# Altium schematic sheet DAC Output.SchDoc
size A3
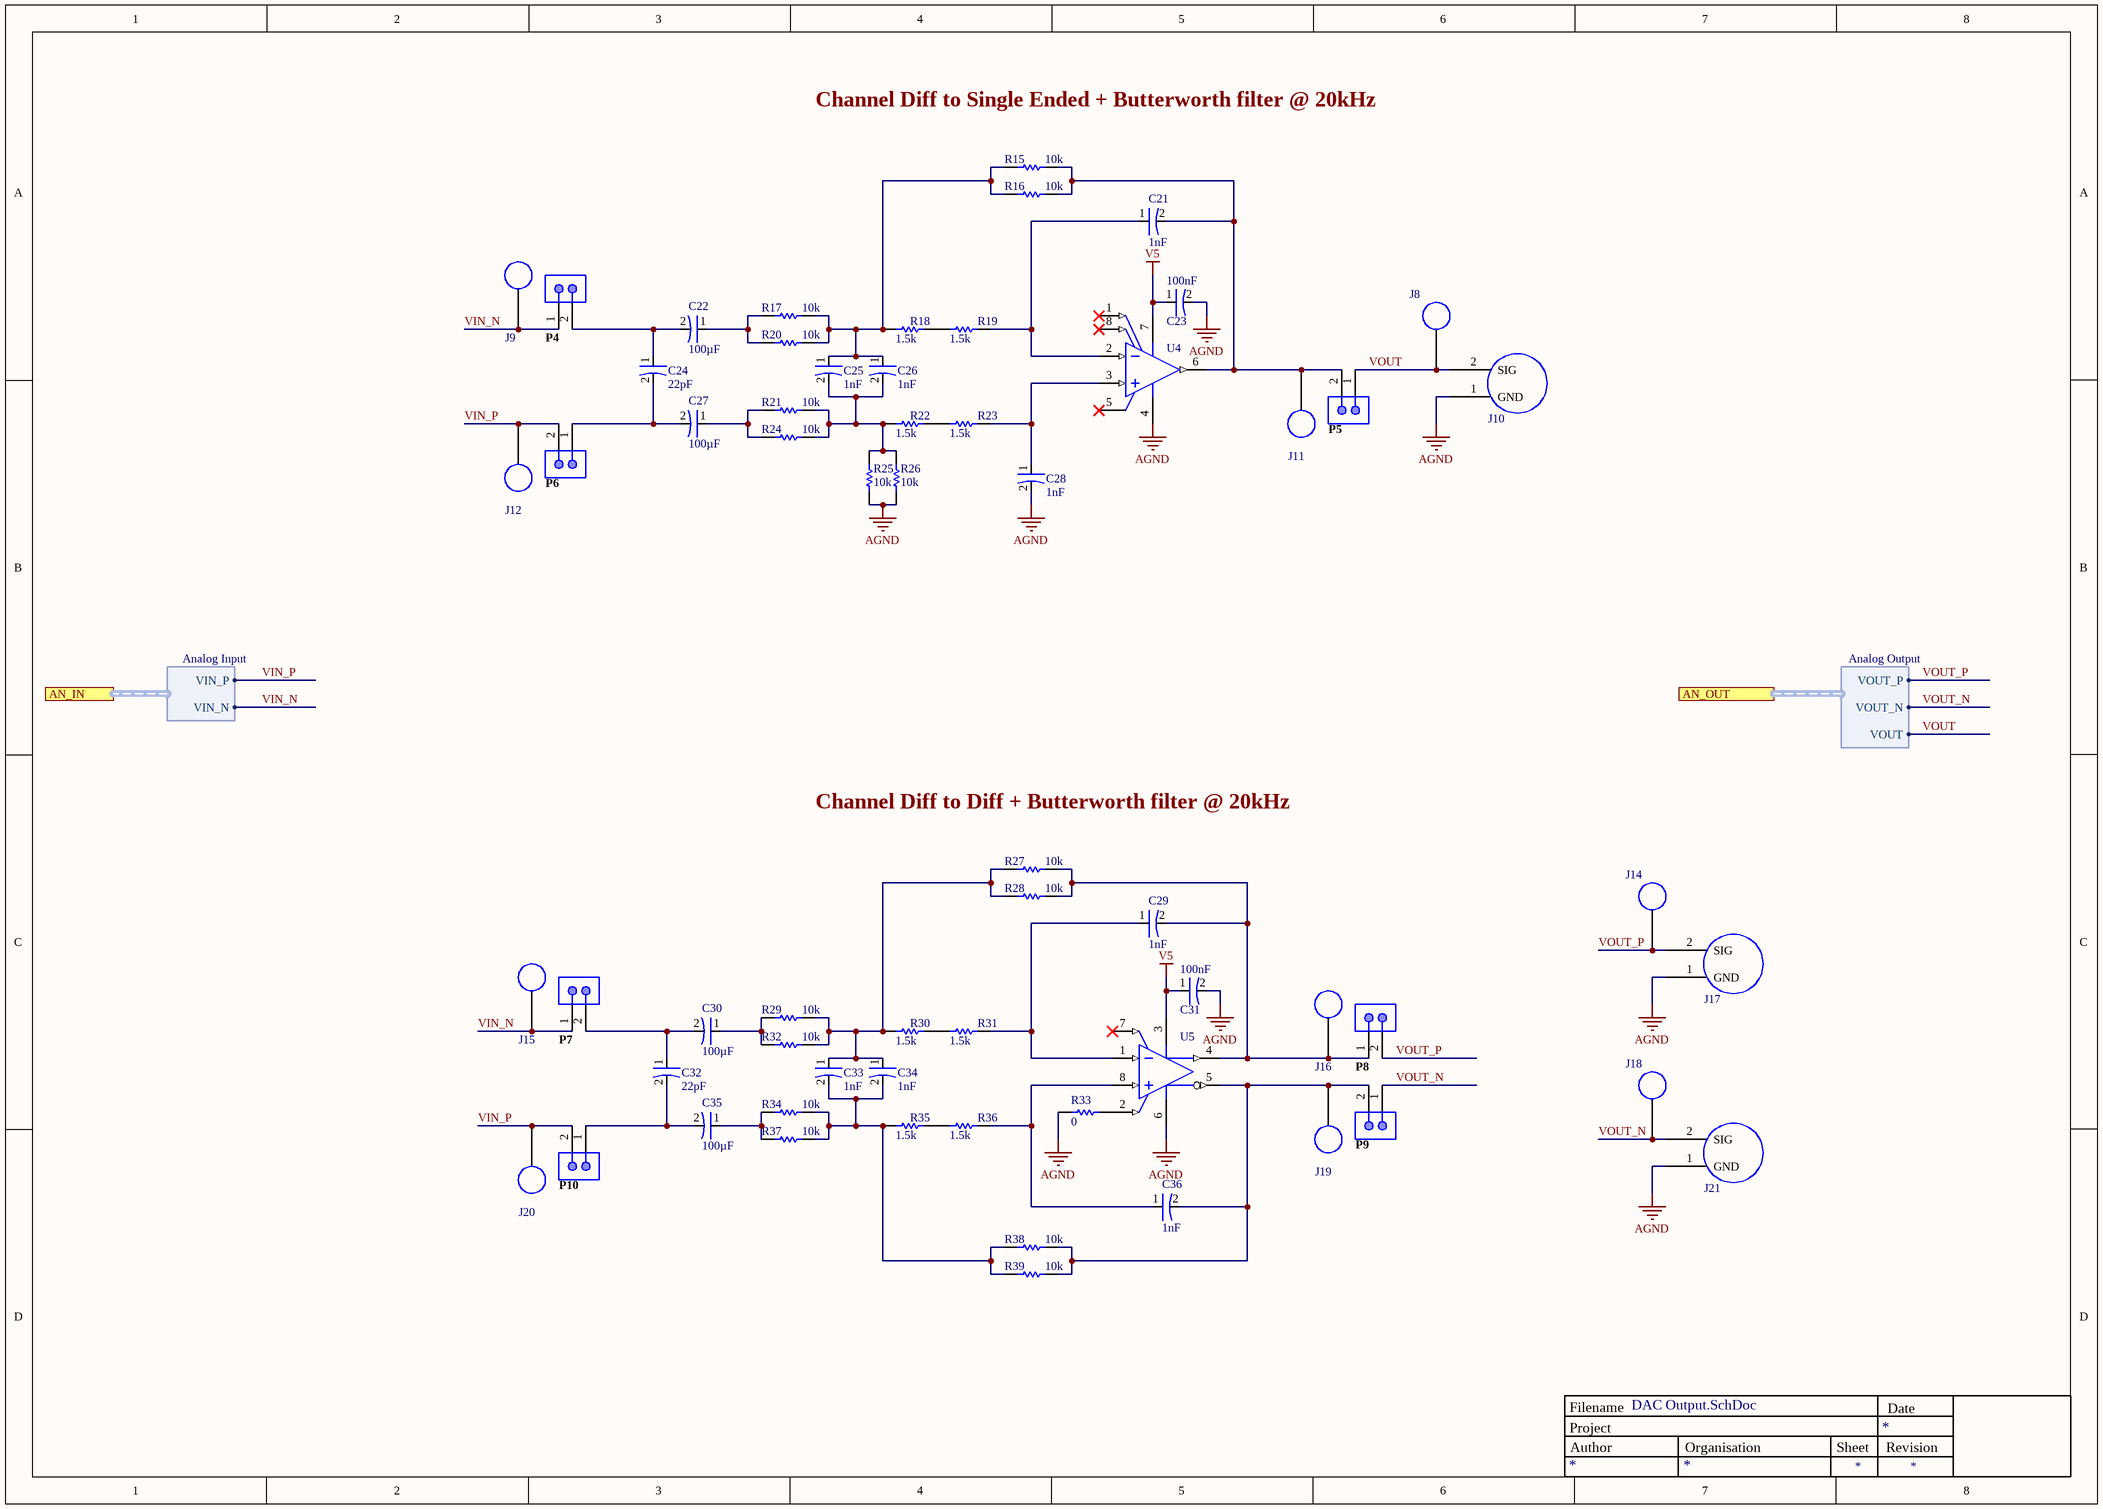
[diagram p0: DAC Output.SchDoc]

## Parts
C21  value 1nF  [0402-M]  (hidden comment: CAP 1nF CER 0402 50V X5R 10%)
C22  value 100µF  [1210-M]  (hidden comment: CAP 100uF CER 1210 16V X5R 20%)
C23  value 100nF  [0805-M]  (hidden comment: CAP 0.1uF CER 0805 50V  X7R 5%)
C24  value 22pF  [0805-M]  (hidden comment: CAP 22pF CER 0805 50V C0G 2%)
C25  value 1nF  [0402-M]  (hidden comment: CAP 1nF CER 0402 50V X5R 10%)
C26  value 1nF  [0402-M]  (hidden comment: CAP 1nF CER 0402 50V X5R 10%)
C27  value 100µF  [1210-M]  (hidden comment: CAP 100uF CER 1210 16V X5R 20%)
C28  value 1nF  [0402-M]  (hidden comment: CAP 1nF CER 0402 50V X5R 10%)
C29  value 1nF  [0402-M]  (hidden comment: CAP 1nF CER 0402 50V X5R 10%)
C30  value 100µF  [1210-M]  (hidden comment: CAP 100uF CER 1210 16V X5R 20%)
C31  value 100nF  [0805-M]  (hidden comment: CAP 0.1uF CER 0805 50V  X7R 5%)
C32  value 22pF  [0805-M]  (hidden comment: CAP 22pF CER 0805 50V C0G 2%)
C33  value 1nF  [0402-M]  (hidden comment: CAP 1nF CER 0402 50V X5R 10%)
C34  value 1nF  [0402-M]  (hidden comment: CAP 1nF CER 0402 50V X5R 10%)
C35  value 100µF  [1210-M]  (hidden comment: CAP 100uF CER 1210 16V X5R 20%)
C36  value 1nF  [0402-M]  (hidden comment: CAP 1nF CER 0402 50V X5R 10%)
J8  151-203-RC  [151-203-RC-Footprint-1]  (value not drawn)
J9  151-203-RC  [151-203-RC-Footprint-1]  (value not drawn)
J10  SMA CONNECTOR  [SMA CONNECTOR-Footprint-1]  (value not drawn)
J11  151-203-RC  [151-203-RC-Footprint-1]  (value not drawn)
J12  151-203-RC  [151-203-RC-Footprint-1]  (value not drawn)
J14  151-203-RC  [151-203-RC-Footprint-1]  (value not drawn)
J15  151-203-RC  [151-203-RC-Footprint-1]  (value not drawn)
J16  151-203-RC  [151-203-RC-Footprint-1]  (value not drawn)
J17  SMA CONNECTOR  [SMA CONNECTOR-Footprint-1]  (value not drawn)
J18  151-203-RC  [151-203-RC-Footprint-1]  (value not drawn)
J19  151-203-RC  [151-203-RC-Footprint-1]  (value not drawn)
J20  151-203-RC  [151-203-RC-Footprint-1]  (value not drawn)
J21  SMA CONNECTOR  [SMA CONNECTOR-Footprint-1]  (value not drawn)
P4  GENERIC 2PIN HEADER MALE  [GENERIC 2PIN HEADER 0]  (value not drawn)
P5  GENERIC 2PIN HEADER MALE  [GENERIC 2PIN HEADER 0]  (value not drawn)
P6  GENERIC 2PIN HEADER MALE  [GENERIC 2PIN HEADER 0]  (value not drawn)
P7  GENERIC 2PIN HEADER MALE  [GENERIC 2PIN HEADER 0]  (value not drawn)
P8  GENERIC 2PIN HEADER MALE  [GENERIC 2PIN HEADER 0]  (value not drawn)
P9  GENERIC 2PIN HEADER MALE  [GENERIC 2PIN HEADER 0]  (value not drawn)
P10  GENERIC 2PIN HEADER MALE  [GENERIC 2PIN HEADER 0]  (value not drawn)
R15  value 10k  [0805-M]  (hidden comment: RES 10k 0805 125mW 1%)
R16  value 10k  [0805-M]  (hidden comment: RES 10k 0805 125mW 1%)
R17  value 10k  [0805-M]  (hidden comment: RES 10k 0805 125mW 1%)
R18  value 1.5k  [0402-M]  (hidden comment: RES 1.5k 0402 63mW 5%)
R19  value 1.5k  [0402-M]  (hidden comment: RES 1.5k 0402 63mW 5%)
R20  value 10k  [0805-M]  (hidden comment: RES 10k 0805 125mW 1%)
R21  value 10k  [0805-M]  (hidden comment: RES 10k 0805 125mW 1%)
R22  value 1.5k  [0402-M]  (hidden comment: RES 1.5k 0402 63mW 5%)
R23  value 1.5k  [0402-M]  (hidden comment: RES 1.5k 0402 63mW 5%)
R24  value 10k  [0805-M]  (hidden comment: RES 10k 0805 125mW 1%)
R25  value 10k  [0805-M]  (hidden comment: RES 10k 0805 125mW 1%)
R26  value 10k  [0805-M]  (hidden comment: RES 10k 0805 125mW 1%)
R27  value 10k  [0805-M]  (hidden comment: RES 10k 0805 125mW 1%)
R28  value 10k  [0805-M]  (hidden comment: RES 10k 0805 125mW 1%)
R29  value 10k  [0805-M]  (hidden comment: RES 10k 0805 125mW 1%)
R30  value 1.5k  [0402-M]  (hidden comment: RES 1.5k 0402 63mW 5%)
R31  value 1.5k  [0402-M]  (hidden comment: RES 1.5k 0402 63mW 5%)
R32  value 10k  [0805-M]  (hidden comment: RES 10k 0805 125mW 1%)
R33  value 0  [0402-M]  (hidden comment: RES 0 0402 63mW)
R34  value 10k  [0805-M]  (hidden comment: RES 10k 0805 125mW 1%)
R35  value 1.5k  [0402-M]  (hidden comment: RES 1.5k 0402 63mW 5%)
R36  value 1.5k  [0402-M]  (hidden comment: RES 1.5k 0402 63mW 5%)
R37  value 10k  [0805-M]  (hidden comment: RES 10k 0805 125mW 1%)
R38  value 10k  [0805-M]  (hidden comment: RES 10k 0805 125mW 1%)
R39  value 10k  [0805-M]  (hidden comment: RES 10k 0805 125mW 1%)
U4  OPA227UA/2K5  [D0008A_L]  (value not drawn)
U5  OPA1632DR  [D0008A_L]  (value not drawn)

## Ports
AN_IN (harness Analog Input), AN_OUT (harness Analog Output)

## Harnesses
Analog Input: VIN_P, VIN_N
Analog Output: VOUT_P, VOUT_N, VOUT

## Nets
AGND: C23.2(Cathode) C28.2(Cathode) C31.2(Cathode) J10.1(GND) J17.1(GND) J21.1(GND) R25.1 R26.1 R33.1 U4.4(V-) U5.6(V-)
V5: C23.1(Anode) C31.1(Anode) U4.7(V+) U5.3(V+)
VIN_N: J9.1 J15.1 P4.1 P7.1 ; port AN_IN.VIN_N
VIN_P: J12.1 J20.1 P6.2 P10.2 ; port AN_IN.VIN_P
VOUT: J8.1 J10.2(SIG) P5.1 ; port AN_OUT.VOUT
VOUT_N: J18.1 J21.2(SIG) P9.1 ; port AN_OUT.VOUT_N
VOUT_P: J14.1 J17.2(SIG) P8.2 ; port AN_OUT.VOUT_P
NetC21_1: C21.1(Anode) R19.2 U4.2(IN-)
NetC21_2: C21.2(Cathode) J11.1 P5.2 R15.2 R16.2 U4.6(OUT)
NetC22_1: C22.1(Anode) R17.1 R20.1
NetC22_2: C22.2(Cathode) C24.1(Anode) P4.2
NetC24_2: C24.2(Cathode) C27.2(Cathode) P6.1
NetC25_1: C25.1(Anode) C26.1(Anode) R15.1 R16.1 R17.2 R18.1 R20.2
NetC25_2: C25.2(Cathode) C26.2(Cathode) R21.2 R22.1 R24.2 R25.2 R26.2
NetC27_1: C27.1(Anode) R21.1 R24.1
NetC28_1: C28.1(Anode) R23.2 U4.3(IN+)
NetC29_1: C29.1(Anode) R31.2 U5.1(VIN-)
NetC29_2: C29.2(Cathode) J16.1 P8.1 R27.2 R28.2 U5.4(VOUT+)
NetC30_1: C30.1(Anode) R29.1 R32.1
NetC30_2: C30.2(Cathode) C32.1(Anode) P7.2
NetC32_2: C32.2(Cathode) C35.2(Cathode) P10.1
NetC33_1: C33.1(Anode) C34.1(Anode) R27.1 R28.1 R29.2 R30.1 R32.2
NetC33_2: C33.2(Cathode) C34.2(Cathode) R34.2 R35.1 R37.2 R38.2 R39.2
NetC35_1: C35.1(Anode) R34.1 R37.1
NetC36_1: C36.1(Anode) R36.2 U5.8(VIN+)
NetC36_2: C36.2(Cathode) J19.1 P9.2 R38.1 R39.1 U5.5(VOUT-)
NetR18_2: R18.2 R19.1
NetR22_2: R22.2 R23.1
NetR30_2: R30.2 R31.1
NetR33_2: R33.2 U5.2(VOCM)
NetR35_2: R35.2 R36.1

Not connected (* = marked no-connect by the designer): U4 1(TRIM)* 5(NC)* 8(TRIM)*; U5 7(ENABLE)*

## Notes on the sheet
- Channel Diff to Single Ended + Butterworth filter @ 20kHz
- Channel Diff to Diff + Butterworth filter @ 20kHz
- Project
- Filename
- Author
- Organisation
- Sheet
- Revision
- Date
  Date

## Library data of the parts
C21 C25 C26 C28 C29 C33 C34 C36 = CAP 1nF CER 0402 50V X5R 10%-2: CAP-1nF-CER-0402-50V-X5R-10%; Manufacturer: Generic; Bin: N; Type: SMD; Status: Active; Source: Capacitor Library.SchLib; Supplier 1: Mouser; Case/Package: 0402; Supplier Part Number 1: 81-GRM155R61H102KA1D; Design Item ID: CAP 1nF CER 0402 50V X5R 10%
C22 C27 C30 C35 = CAP 100uF CER 1210 16V X5R 20%-2: CAP-100uF-CER-1210-16V-X5R-20%; Manufacturer: Generic; Bin: F1-C5-1 / F1-C2-8; Type: SMD; Case/Package: 1210; Supplier 1: Digi-Key; Source: Capacitor Library.SchLib; Design Item ID: CAP 100uF CER 1210 16V X5R 20%; Status: Active; Supplier Part Number 1: 587-3152-6-ND
C23 C31 = CAP 0.1uF CER 0805 50V  X7R 5%-2: CAP-0.1uF-CER-0805-50V- X7R-5%; Manufacturer: Generic; Bin: F1-C6-4; Type: SMD; Design Item ID: CAP 0.1uF CER 0805 50V  X7R 5%; Supplier 1: Mouser; Datasheet: http://www.kemet.com/Lists/ProductCatalog/Attachments/53/KEM_C1002_X7R_SMD.pdf; Source: Capacitor Library.SchLib; Case/Package: 0805; Status: Active; Supplier Part Number 1: 80-C0805C104J3R
C24 C32 = CAP 22pF CER 0805 50V C0G 2%-2: Manufacturer: Generic; Type: SMD; Supplier 1: Mouser; Design Item ID: CAP 22pF CER 0805 50V C0G 2%; Source: Capacitor Library.SchLib; Supplier Part Number 1: 77-VJ0805A220GXACBC; Case/Package: 0805
J8 J9 J11 J12 J14-J16 J18-J20 = CMP-002-00000-2: PCB-Probe-Ring; Color: Black
J10 J17 J21 = CMP-002-00001-2: Manufacturer: LPRS; Connector Type: SMA,Coaxial; Max Frequency: 6GHz; Impedance: 50R; Supplier No: 471-SMACONNECTOR; Contact Material: Gold; Supplier: Mouser; REACH SVHC: No SVHC; Case/Package: SMA; Contact Plating: Gold
P4-P10 = GENERIC 2PIN HEADER MALE-2: CONN MAL TH 2 0Deg HEADER; Bin: B3-J5; Manufacturer: Generic; Design Item ID: GENERIC 2PIN HEADER MALE; Type: TH; Status: Active; Source: Connector Library.SchLib; Case/Package: n/a PIN
R15-R17 R20 R21 R24-R29 R32 R34 R37-R39 = RES 10k 0805 125mW 1%-1: RES-10k-0805-125mW-1%; Manufacturer: Generic; MAPPING: 1(2,1,10k); Bin: F1-R12-10; Design Item ID: RES 10k 0805 125mW 1%; Case/Package: 0805; Type: SMD; Status: Active; Source: Resistor Library.SchLib
R18 R19 R22 R23 R30 R31 R35 R36 = RES 1.5k 0402 63mW 5%-1: RES-1.5k-0402-63mW-5%; Manufacturer: Generic; MAPPING: 1(2,1,11.5k); Bin: F1-RM1-1; Case/Package: 0402; Source: Resistor Library.SchLib; Type: SMD; Status: Active; Design Item ID: RES 1.5k 0402 63mW 5%
R33 = RES 0 0402 63mW-1: RES-0-0402-63mW-5%; Manufacturer: Generic; MAPPING: 1(2,1,11.5k); Bin: F1-RM1-5; Source: Resistor Library.SchLib; Design Item ID: RES 0 0402 63mW; Case/Package: 0402; Type: SMD; Status: Active
U4 = CMP-019-00001-1: IC OPAMP GP 8MHZ 8SOIC; Slew Rate: 2.3V/µs; Input Bias Current: 10nA; Max Supply Voltage: 18V; Input Offset Voltage (Vos): 200uV; Operating Supply Current: 3.7mA; Number of Circuits: 1; Output Current per Channel: 45mA; Nominal Supply Current: 3.8mA; Common Mode Rejection Ratio: 120dB; Voltage Gain: 160dB; Power Supply Rejection Ratio (PSRR): 126.02dB; Min Dual Supply Voltage: 2.5V; Number of Pins: 8; Radiation Hardening: No; Max Dual Supply Voltage: 18V; Packaging: Tape and Reel; Max I/O Voltage: 200uV; Contact Plating: Gold; Number of Channels: 1; Case/Package: D; Gain Bandwidth Product: 8MHz; Min Operating Temperature: -40°C; Nominal Gain Bandwidth Product: 8MHz; Max Operating Temperature: 85°C; Unity Gain Bandwidth Product: 8MHz; Output Current: 45mA; Bandwidth: 8MHz; Package Quantity: 2500; Number of Elements: 1; Lead Free: Lead Free
U5 = CMP-019-00002-1: IC OPAMP AUDIO 180MHZ 8SOIC; Operating Supply Current: 14mA; Min Supply Voltage: 5V; Voltage Gain: 78dB; Max Supply Voltage: 32V; Max Dual Supply Voltage: 16V; Number of Circuits: 1; Output Current: 85mA; Power Supply Rejection Ratio (PSRR): 70dB; Input Offset Voltage (Vos): 3mV; Min Dual Supply Voltage: 2.5V; Common Mode Rejection Ratio: 74dB; Slew Rate: 50V/µs; Dual Supply Voltage: 15V; Max Power Dissipation: 2W; Input Bias Current: 2uA; Supply Type: Single,Dual; Gain Bandwidth Product: 180MHz; Package Quantity: 2500; Case/Package: D; Bandwidth: 180MHz; Nominal Gain Bandwidth Product: 180MHz; -3db Bandwidth: 180MHz; Number of Pins: 8; Number of Elements: 1; Output Current per Channel: 85mA; Radiation Hardening: No; Number of Channels: 1; Nominal Supply Current: 14mA; Gain: 78dB; Max Operating Temperature: 85°C; Weight: 0.002677oz; Packaging: Tape and Reel; Min Operating Temperature: -40°C; Lead Free: Lead Free; Contact Plating: Gold